# EAGLE design BatteryCombinerControlBoard (EAGLE 9.3.2)
Assembly variants: Wing, Hull

## Sheet 1 of 2
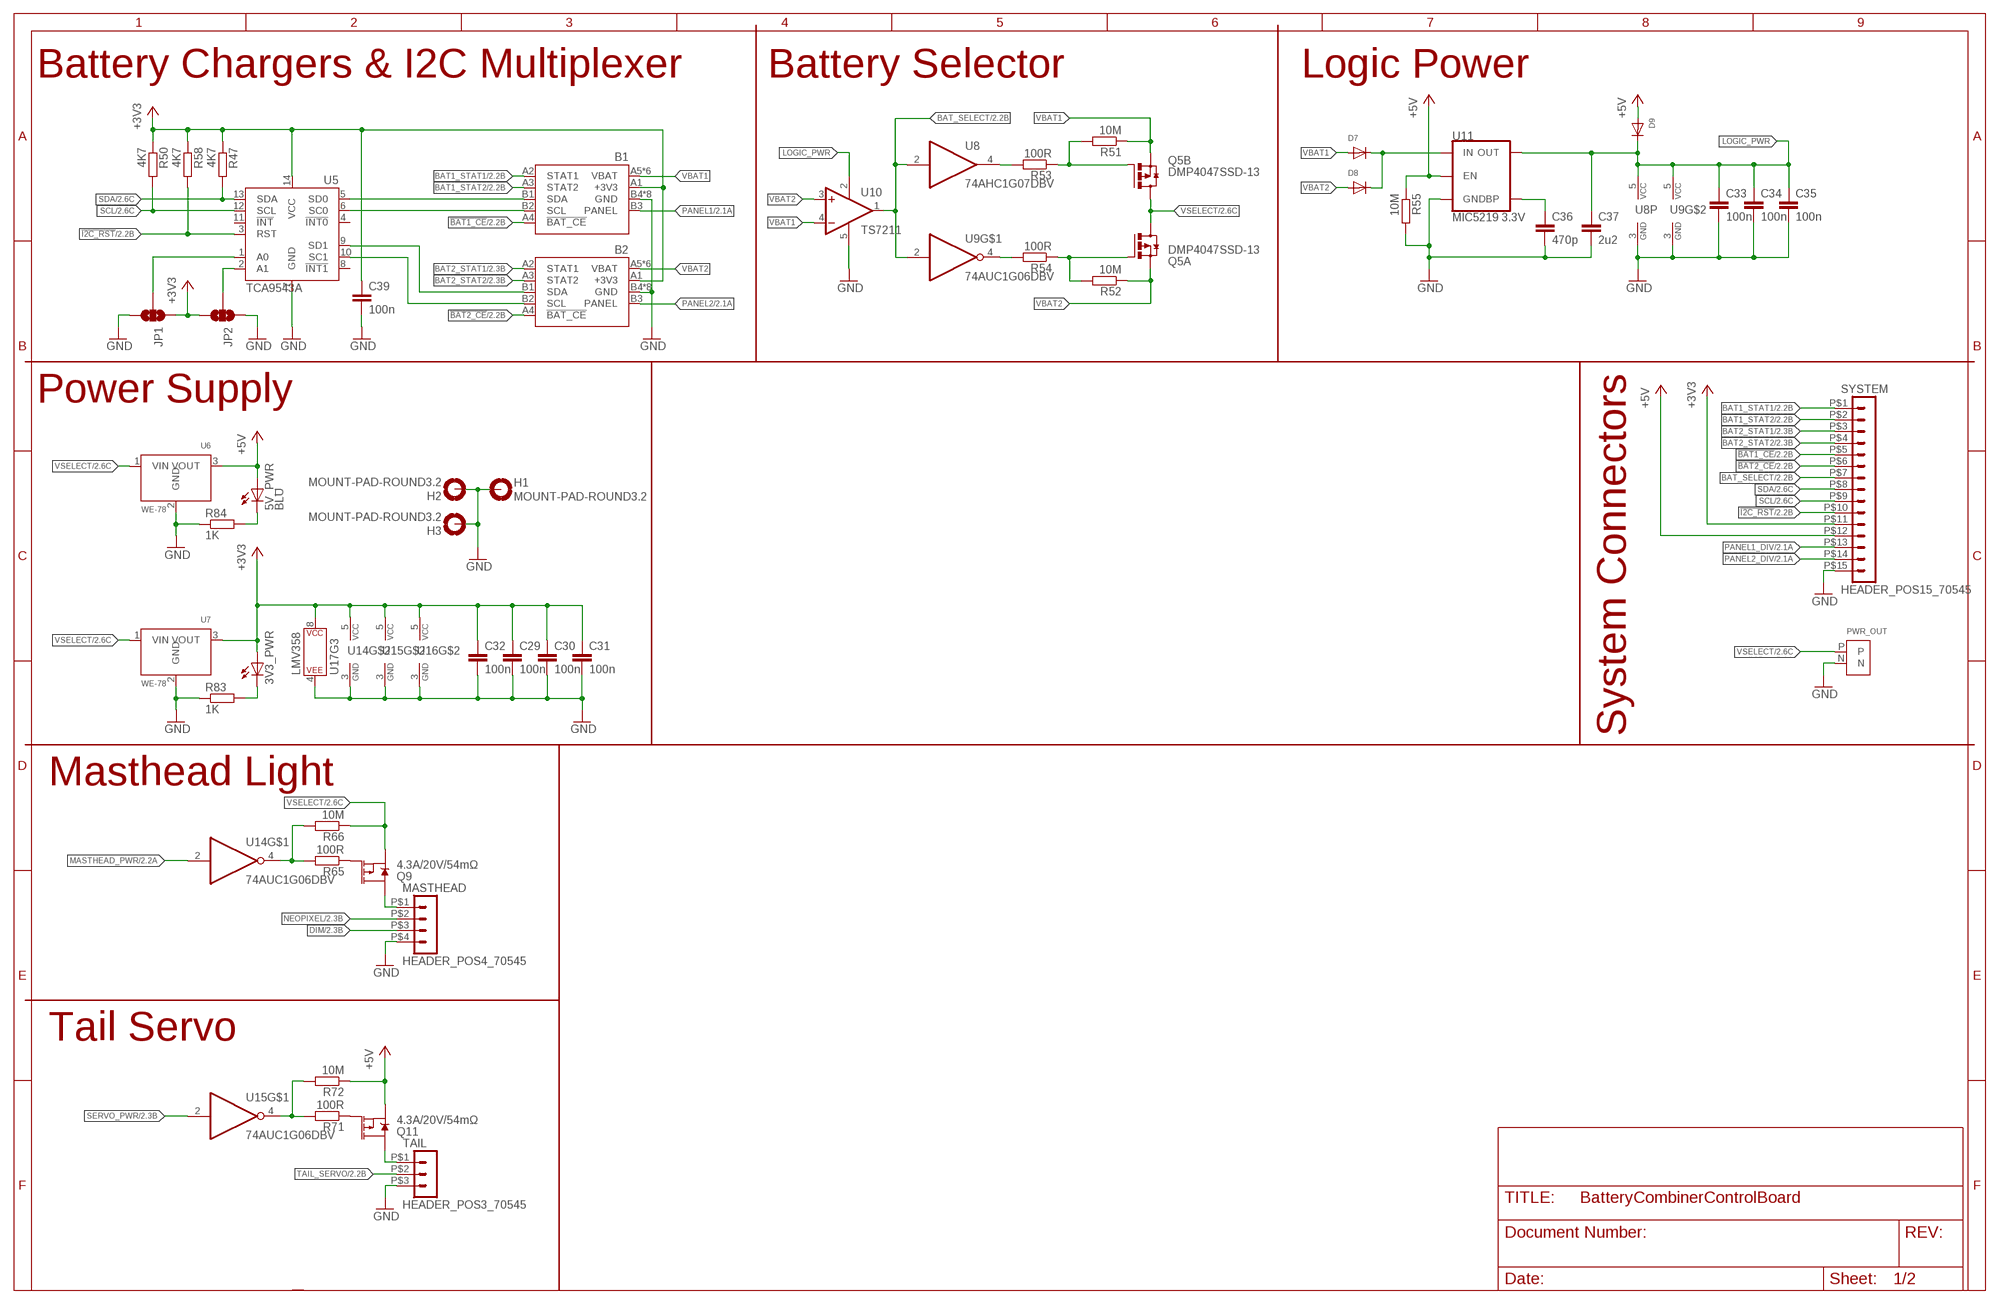
[diagram p0: schematic, sheet 1]

### Parts
3V3_PWR  GRN  LEDCHIP-LED0603  [CHIP-LED0603]
5V_PWR  BLU  LEDCHIP-LED0603  [CHIP-LED0603]
B1  MPPTCHARGER  [MPPTCHARGER]
B2  MPPTCHARGER  [MPPTCHARGER]
C29  100n  C-EUC0603  [C0603]
C30  100n  C-EUC0603  [C0603]
C31  100n  C-EUC0603  [C0603]
C32  100n  C-EUC0603  [C0603]
C33  100n  C-EUC0603  [C0603]
C34  100n  C-EUC0603  [C0603]
C35  100n  C-EUC0603  [C0603]
C36  470p  C-EUC0603  [C0603]
C37  2u2  C-EUC0603  [C0603]
C39  100n  C-EUC0603  [C0603]
D7  DIODESOD-123  [SOD-123]
D8  DIODESOD-123  [SOD-123]
D9  DIODESOD-123  [SOD-123]
H1  MOUNT-PAD-ROUND3.2  [3,2-PAD]  (not fitted in variant Wing)  (not fitted in variant Hull)
H2  MOUNT-PAD-ROUND3.2  [3,2-PAD]  (not fitted in variant Wing)  (not fitted in variant Hull)
H3  MOUNT-PAD-ROUND3.2  [3,2-PAD]  (not fitted in variant Wing)  (not fitted in variant Hull)
JP1  JUMPER-SMT_3_NO_SILK  [SMT-JUMPER_3_NO_SILK]  (not fitted in variant Wing)  (not fitted in variant Hull)
JP2  JUMPER-SMT_3_NO_SILK  [SMT-JUMPER_3_NO_SILK]  (not fitted in variant Wing)  (not fitted in variant Hull)
MASTHEAD  HEADER_POS4_70545  [70545-POS4]  (not fitted in variant Hull)
PWR_OUT  PWR  [JST-XH2-THRUHOLE]  (not fitted in variant Wing)
Q5  DMP4047SSD-13  [SO08]
Q9  4.3A/20V/54mΩ  MOSFET_PCH-IRLML2244  [SOT23-3]
Q11  4.3A/20V/54mΩ  MOSFET_PCH-IRLML2244  [SOT23-3]
R47  4K7  R-EU_R0603  [R0603]
R50  4K7  R-EU_R0603  [R0603]
R51  10M  R-EU_R0603  [R0603]
R52  10M  R-EU_R0603  [R0603]
R53  100R  R-EU_R0603  [R0603]
R54  100R  R-EU_R0603  [R0603]
R55  10M  R-EU_R0603  [R0603]
R58  4K7  R-EU_R0603  [R0603]
R65  100R  R-EU_R0603  [R0603]
R66  10M  R-EU_R0603  [R0603]
R71  100R  R-EU_R0603  [R0603]
R72  10M  R-EU_R0603  [R0603]
R83  1K  R-EU_R0603  [R0603]
R84  1K  R-EU_R0603  [R0603]
SYSTEM  HEADER_POS15_70545  [70545-POS15]  (not fitted in variant Wing)
TAIL  HEADER_POS3_70545  [70545-POS3]  (not fitted in variant Hull)
U5  TCA9543A  [SO-14]
U6  WE-78  [WE-78]
U7  WE-78  [WE-78]
U8  74AHC1G07DBV  [SOT23-5]
U9  74AUC1G06DBV  [SOT23-5]
U10  TS7211  [DBV-R-PDSO-G5]
U11  MIC5219 3.3V  V_REG_MIC52193.3V  [SOT23-5]
U14  74AUC1G06DBV  [SOT23-5]
U15  74AUC1G06DBV  [SOT23-5]
U16  74AUC1G06DBV  [SOT23-5]
U17  LMV358  LMV358SOIC  [SO08]

### Nets
!BAT1_CE!: B1.A4(!BAT_CE!) SYSTEM.P$5 ; also sheet 2
!BAT2_CE!: B2.A4(!BAT_CE!) SYSTEM.P$6 ; also sheet 2
!I2C_RST!: R58.2 SYSTEM.P$10 U5.3(RST) ; also sheet 2
+3V3: 3V3_PWR.A B1.A1(+3V3) B2.A1(+3V3) C29.1 C30.1 C31.1 C32.1 C39.1 JP1.1 JP2.3 R47.1 R50.1 R58.1 SYSTEM.P$11 U5.14(VCC) U7.3(VOUT) U14.5(VCC) U15.5(VCC) U16.5(VCC) U17.8(P$V+) ; also sheet 2
+5V: 5V_PWR.A D9.A Q11.2(S) R55.1 R72.1 SYSTEM.P$12 U6.3(VOUT) U11.3(EN) ; also sheet 2
BAT1_STAT1: B1.A2(STAT1) SYSTEM.P$1 ; also sheet 2
BAT1_STAT2: B1.A3(STAT2) SYSTEM.P$2 ; also sheet 2
BAT2_STAT1: B2.A2(STAT1) SYSTEM.P$3 ; also sheet 2
BAT2_STAT2: B2.A3(STAT2) SYSTEM.P$4 ; also sheet 2
BAT_SELECT: SYSTEM.P$7 U8.2(I) U9.2(I) U10.1(OUT) ; also sheet 2
DIM: MASTHEAD.P$3 ; also sheet 2
GND: B1.B4(GND) B1.B5(GND) B1.B6(GND) B1.B7(GND) B1.B8(GND) B1.B9(GND) B1.B10(GND) B1.H(GND) B2.B4(GND) B2.B5(GND) B2.B6(GND) B2.B7(GND) B2.B8(GND) B2.B9(GND) B2.B10(GND) B2.H(GND) C29.2 C30.2 C31.2 C32.2 C33.2 C34.2 C35.2 C36.2 C37.2 C39.2 H1.B3,2(MOUNT) H2.B3,2(MOUNT) H3.B3,2(MOUNT) JP1.3 JP2.1 MASTHEAD.P$4 PWR_OUT.N R55.2 R83.1 R84.1 SYSTEM.P$15 TAIL.P$3 U5.7(GND) U6.2(GND) U7.2(GND) U8.3(GND) U9.3(GND) U10.5(GND) U11.2(GND) U14.3(GND) U15.3(GND) U16.3(GND) U17.4(P$V-) ; also sheet 2
LOGIC_PWR: C33.1 C34.1 C35.1 C37.1 D9.C U8.5(VCC) U9.5(VCC) U10.2(V+) U11.5(OUT)
MASTHEAD_PWR: U14.2(I) ; also sheet 2
N$48: Q5.4(B:G) R51.2 R53.1
N$50: JP1.2 U5.1(A0)
N$51: JP2.2 U5.2(A1)
N$52: Q5.2(A:G) R52.2 R54.1
N$54: R54.2 U9.4(O)
N$55: R53.2 U8.4(O)
N$57: D7.C D8.C U11.1(IN)
N$58: MASTHEAD.P$1 Q9.3(D)
N$59: C36.1 U11.4(BP)
N$63: Q9.1(G) R65.1
N$64: R65.2 R66.2 U14.4(O)
N$70: Q11.3(D) TAIL.P$1
N$71: Q11.1(G) R71.1
N$72: R71.2 R72.2 U15.4(O)
N$74: 3V3_PWR.C R83.2
N$77: 5V_PWR.C R84.2
NEOPIXEL: MASTHEAD.P$2 ; also sheet 2
PANEL1: B1.B3(PANEL) ; also sheet 2
PANEL1_DIV: SYSTEM.P$13 ; also sheet 2
PANEL2: B2.B3(PANEL) ; also sheet 2
PANEL2_DIV: SYSTEM.P$14 ; also sheet 2
SCL: R50.2 SYSTEM.P$9 U5.12(SCL) ; also sheet 2
SCL1: B1.B2(SCL) U5.6(SC0)
SCL2: B2.B2(SCL) U5.10(SC1)
SDA: R47.2 SYSTEM.P$8 U5.13(SDA) ; also sheet 2
SDA1: B1.B1(SDA) U5.5(SD0)
SDA2: B2.B1(SDA) U5.9(SD1)
SERVO_PWR: U15.2(I) ; also sheet 2
TAIL_SERVO: TAIL.P$2 ; also sheet 2
VBAT1: B1.A5(VBAT) B1.A6(VBAT) B1.A7(VBAT) B1.A8(VBAT) B1.A9(VBAT) B1.A10(VBAT) D7.A Q5.3(B:S) R51.1 U10.4(-IN)
VBAT2: B2.A5(VBAT) B2.A6(VBAT) B2.A7(VBAT) B2.A8(VBAT) B2.A9(VBAT) B2.A10(VBAT) D8.A Q5.1(A:S) R52.1 U10.3(+IN)
VSELECT: PWR_OUT.P Q5.5(B:D) Q5.6(B:D) Q5.7(A:D) Q5.8(A:D) Q9.2(S) R66.1 U6.1(VIN) U7.1(VIN) ; also sheet 2
Unconnected: U5.4(!INT0!) U5.8(!INT1!) U5.11(!INT!)

### Notes on the sheet
- Battery Chargers & I2C Multiplexer | Battery Selector | Logic Power
- Power Supply | System Connectors
- Masthead Light
- Tail Servo

## Sheet 2 of 2
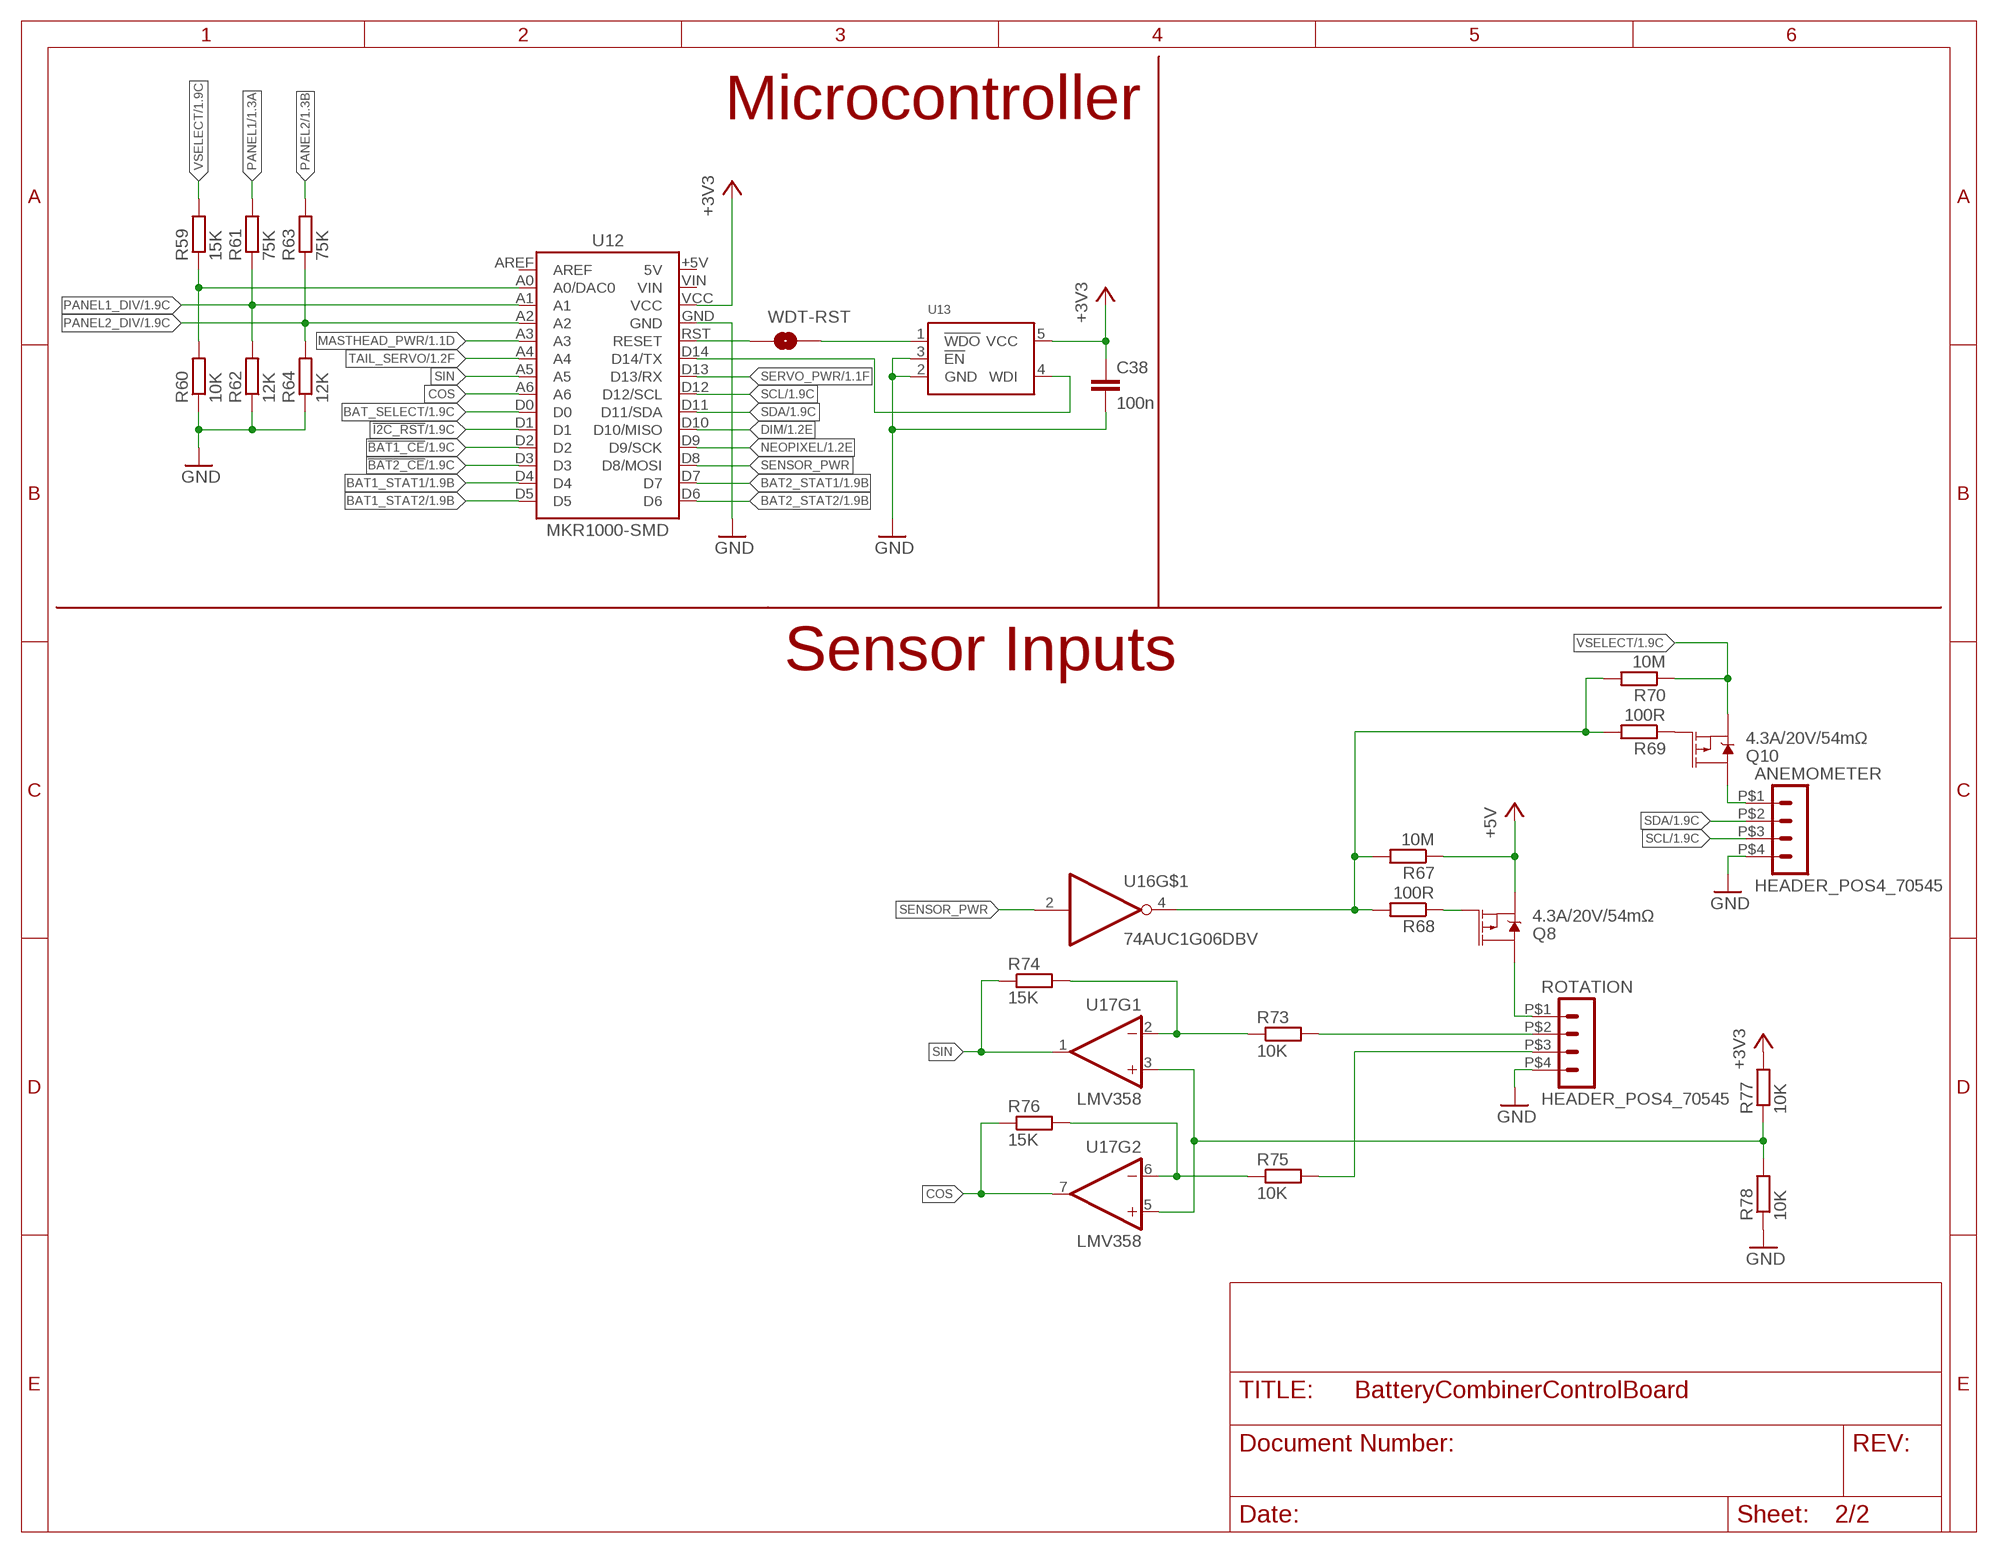
[diagram p1: schematic, sheet 2]

### Parts
ANEMOMETER  HEADER_POS4_70545  [70545-POS4]  (not fitted in variant Hull)
C38  100n  C-EUC0603  [C0603]
Q8  4.3A/20V/54mΩ  MOSFET_PCH-IRLML2244  [SOT23-3]
Q10  4.3A/20V/54mΩ  MOSFET_PCH-IRLML2244  [SOT23-3]
R59  15K  R-EU_R0603  [R0603]
R60  10K  R-EU_R0603  [R0603]
R61  75K  R-EU_R0603  [R0603]
R62  12K  R-EU_R0603  [R0603]
R63  75K  R-EU_R0603  [R0603]
R64  12K  R-EU_R0603  [R0603]
R67  10M  R-EU_R0603  [R0603]
R68  100R  R-EU_R0603  [R0603]
R69  100R  R-EU_R0603  [R0603]
R70  10M  R-EU_R0603  [R0603]
R73  10K  R-EU_R0603  [R0603]
R74  15K  R-EU_R0603  [R0603]
R75  10K  R-EU_R0603  [R0603]
R76  15K  R-EU_R0603  [R0603]
R77  10K  R-EU_R0603  [R0603]
R78  10K  R-EU_R0603  [R0603]
ROTATION  HEADER_POS4_70545  [70545-POS4]  (not fitted in variant Hull)
U12  MKR1000-SMD  [MKR1000-SMD]  (not fitted in variant Hull)
U13  STWD100  [DBV-R-PDSO-G5]  (not fitted in variant Hull)
WDT-RST  JUMPER-SMT_2_NO_SILK  [SMT-JUMPER_2_NO_SILK]  (not fitted in variant Wing)  (not fitted in variant Hull)

### Nets
!BAT1_CE!: U12.D2 ; also sheet 1
!BAT2_CE!: U12.D3 ; also sheet 1
!I2C_RST!: U12.D1 ; also sheet 1
+3V3: C38.1 R77.2 U12.VCC U13.5(VCC) ; also sheet 1
+5V: Q8.2(S) R67.1 ; also sheet 1
BAT1_STAT1: U12.D4 ; also sheet 1
BAT1_STAT2: U12.D5 ; also sheet 1
BAT2_STAT1: U12.D7 ; also sheet 1
BAT2_STAT2: U12.D6 ; also sheet 1
BAT_SELECT: U12.D0 ; also sheet 1
COS: R76.1 U12.A6 U17.7(OUT)
COS_IN: R75.2 ROTATION.P$3
DIM: U12.D10(D10/MISO) ; also sheet 1
GND: ANEMOMETER.P$4 C38.2 R60.1 R62.1 R64.1 R78.1 ROTATION.P$4 U12.GND U13.2(GND) U13.3(!EN!) ; also sheet 1
MASTHEAD_PWR: U12.A3 ; also sheet 1
N$2: Q8.3(D) ROTATION.P$1
N$53: Q8.1(G) R68.1
N$60: R59.1 R60.2 U12.A0(A0/DAC0)
N$61: U12.RST(RESET) WDT-RST.1
N$62: R73.1 R74.2 U17.2(-IN)
N$65: U13.1(!WDO!) WDT-RST.2
N$66: ANEMOMETER.P$1 Q10.3(D)
N$67: Q10.1(G) R69.1
N$68: U12.D14(D14/TX) U13.4(WDI)
N$69: R67.2 R68.2 R69.2 R70.2 U16.4(O)
N$73: R75.1 R76.2 U17.6(-IN)
N$78: R77.1 R78.2 U17.3(+IN) U17.5(+IN)
NEOPIXEL: U12.D9(D9/SCK) ; also sheet 1
PANEL1: R61.2 ; also sheet 1
PANEL1_DIV: R61.1 R62.2 U12.A1 ; also sheet 1
PANEL2: R63.2 ; also sheet 1
PANEL2_DIV: R63.1 R64.2 U12.A2 ; also sheet 1
SCL: ANEMOMETER.P$3 U12.D12(D12/SCL) ; also sheet 1
SDA: ANEMOMETER.P$2 U12.D11(D11/SDA) ; also sheet 1
SENSOR_PWR: U12.D8(D8/MOSI) U16.2(I)
SERVO_PWR: U12.D13(D13/RX) ; also sheet 1
SIN: R74.1 U12.A5 U17.1(OUT)
SIN_IN: R73.2 ROTATION.P$2
TAIL_SERVO: U12.A4 ; also sheet 1
VSELECT: Q10.2(S) R59.2 R70.1 ; also sheet 1
Unconnected: U12.+5V(5V) U12.AREF U12.VIN

### Notes on the sheet
- Microcontroller
- Sensor Inputs

## Library data of the parts
3V3_PWR 5V_PWR = adafruit:LED: LED OSRAM: - CHIPLED LG R971, LG N971, LY N971, LG Q971, LY Q971, LO R971, LY R971 LH N974, LH R974 LS Q976, LO Q976, LY Q976 LO Q996 - Hyper CHIPLED LW Q18S LB Q993, LB Q99A, LB R99A - SideLED LS A670, LO A670, LY A670, LG A670, LP A670 LB A673, LV A673, LT A673, LW A673 LH A674 LY A675 LS A676, LA A676, LO A676, LY A676, LW A676 LS A679, LY A679, LG A679 - Hyper Micro SIDELED® LS Y876, LA Y876, LO Y876, LY Y876 LT Y87S - SmartLED LW L88C, LW L88S LB L89C, LB L89S, LG L890 LS L89K, LO L89K, LY L89K LS L896, LA L896, LO L896, LY L896 - TOPLED LS T670, LO T670, LY T670, LG T670, LP T670 LSG T670, LSP T670, LSY T670, LOP T670, LYG T670 LG T671, LOG T671, LSG T671 LB T673, LV T673, LT T673, LW T673 LH T674 LS T676, LA T676, LO T676, LY T676, LB T676, LH T676, LSB T676, LW T676 LB T67C, LV T67C, LT T67C, LS T67K, LO T67K, LY T67K, LW E67C LS E67B, LA E67B, LO E67B, LY E67B, LB E67C, LV E67C, LT E67C LW T67C LS T679, LY T679, LG T679 LS T770, LO T770, LY T770, LG T770, LP T770 LB T773, LV T773, LT T773, LW T773 LH T774 LS E675, LA E675, LY E675, LS T675 LS T776, LA T776, LO T776, LY T776, LB T776 LHGB T686 LT T68C, LB T68C - Hyper Mini TOPLED® LB M676 - Mini TOPLED Santana® LG M470 LS M47K, LO M47K, LY M47K Source: http://www.osram.convergy.de/
ANEMOMETER MASTHEAD ROTATION = con-molex-c-grid-sl:HEADER_POS4_?: Molex -C-Grid® / SL Series connector Wire-to-Board 2.54 mm (0.100") pitch header, 4 positions.
B1 B2 = CombinerBoardFootprint:MPPTCHARGER
C29-C39 = resistor:C-EU: CAPACITOR, European symbol
D7-D9 = adafruit:DIODE: Diode SMADIODE - SMA Surface Mount Package 20V 1A Schottky Diode Digikey: 641-1014-6-ND DO-1N4148 - Through Hole Small Current Diode SOD-123 20V 1 A (.5mV Vf) Schottky Diode - Digikey: MBRX120TPMSCT-ND SOD-323 10V 570mA (.38mV Vf, 3ns) Schottky Diode - Digikey: ZLLS410CT-ND SOD-523 30V 30mA Schottky Diode (RB751S-40TE61) - Digikey: RB751S-40TE61CT-ND SOT23-R/W - SOT23 Package (R = Solder Paste/Reflow Ovens, W = Hand-Soldering) BAT54Film 40V 300mA - Digikey: 497-7162-1-ND
H1-H3 = holes:MOUNT-PAD-ROUND: MOUNTING PAD, round
JP1 JP2 = SparkFun-Jumpers:JUMPER-SMT_3_NO: Normally open jumper This jumper has three pads in close proximity to each other. Apply solder to close the connection(s).
PWR_OUT = PowerComponents:PWR
Q5 = PowerComponents:DMP4047SSD-13: Dual P MOSFET
Q8-Q11 = SparkFun-DiscreteSemi:MOSFET_PCH: P-channel MOSFETs Voltage controlled devices that allow control of high current outputs. SparkFun Products: SparkFun ESP32 Thing <https://www.sparkfun.com/products/13907> SparkFun ESP8266 Thing <https://www.sparkfun.com/products/13231>; PROD_ID: TRANS-11153
R47 R50-R55 R58-R78 R83 R84 = resistor:R-EU_: RESISTOR, European symbol
SYSTEM = con-molex-c-grid-sl:HEADER_POS15_?: Molex -C-Grid® / SL Series connector Wire-to-Board 2.54 mm (0.100") pitch header, 15 positions.
TAIL = con-molex-c-grid-sl:HEADER_POS3_?: Molex -C-Grid® / SL Series connector Wire-to-Board 2.54 mm (0.100") pitch header, 3 positions.
U5 = PowerComponents:TCA9543A: 2 port I2C mux
U6 U7 = PowerComponents:WE-78
U8 = 74xx-little-us:74*1G07: Single Buffer/Driver With Open-Drain Output
U9 U14-U16 = 74xx-little-us:74*1G06: Single Inverter Buffer/Driver With Open-Drain Output
U10 = PowerComponents:TS7211: Single rail to rail differential comparator. Source: datasheet <http://www.st.com/content/ccc/resource/technical/document/datasheet/3e/f6/43/6f/0f/1f/48/68/CD00003022.pdf/files/CD00003022.pdf/jcr:content/translations/en.CD00003022.pdf>
U11 = SparkFun-IC-Power:V_REG_MIC5219: V_REG MIC5219 Standard 3.3V and 5V 500mA LDO voltage regulator in SOT-23 layout. Micrel part MIC5219. BP (by-pass) pin is used to lower output noise with 470pF cap, may be left open.; PROD_ID: VREG-09872
U12 = arduino-shields:MKR: Through hole version can use any 0.1" headers. SMD version uses Mill-Max p/n 310-43-114-41-105000. This requires a machined-pin header such as the Mill-Max p/n 350-10-114-00-006000.
U13 = PowerComponents:STWD100
U17 = SparkFun-IC-Amplifiers:LMV358: IC LMV358 DUAL OP AMP Jellybean rail-to-rail output op-amp SparkFun Products SparkFun PicoBoard <https://www.sparkfun.com/products/11888> (WIG-11888) SparkFun Vernier Interface Shield <https://www.sparkfun.com/products/12858> (DEV-12858) SparkFun Blynk Board - ESP8266 <https://www.sparkfun.com/products/13794> (WRL-13794) SparkFun Digital Sandbox <https://www.sparkfun.com/products/12651> (DEV-12651 RoHS); PROD_ID: IC-09657
WDT-RST = SparkFun-Jumpers:JUMPER-SMT_2_NO: Normally open jumper This jumper has two pads in close proximity to each other. Apply solder to close the connection. Round pads are easier to solder for beginners, but are a lot larger. SparkFun Product that uses the round pads: SparkFun EL Sequencer <https://www.sparkfun.com/products/12781>

## Board
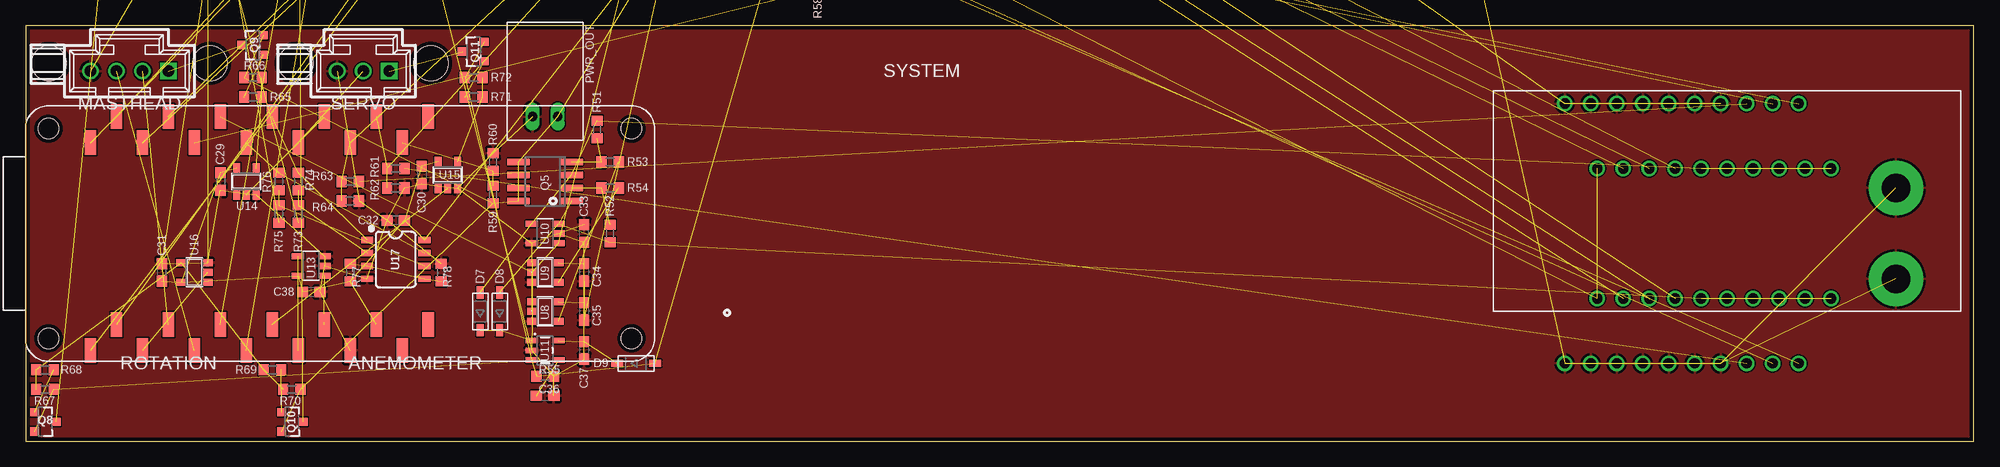
[diagram p2: board, top side]
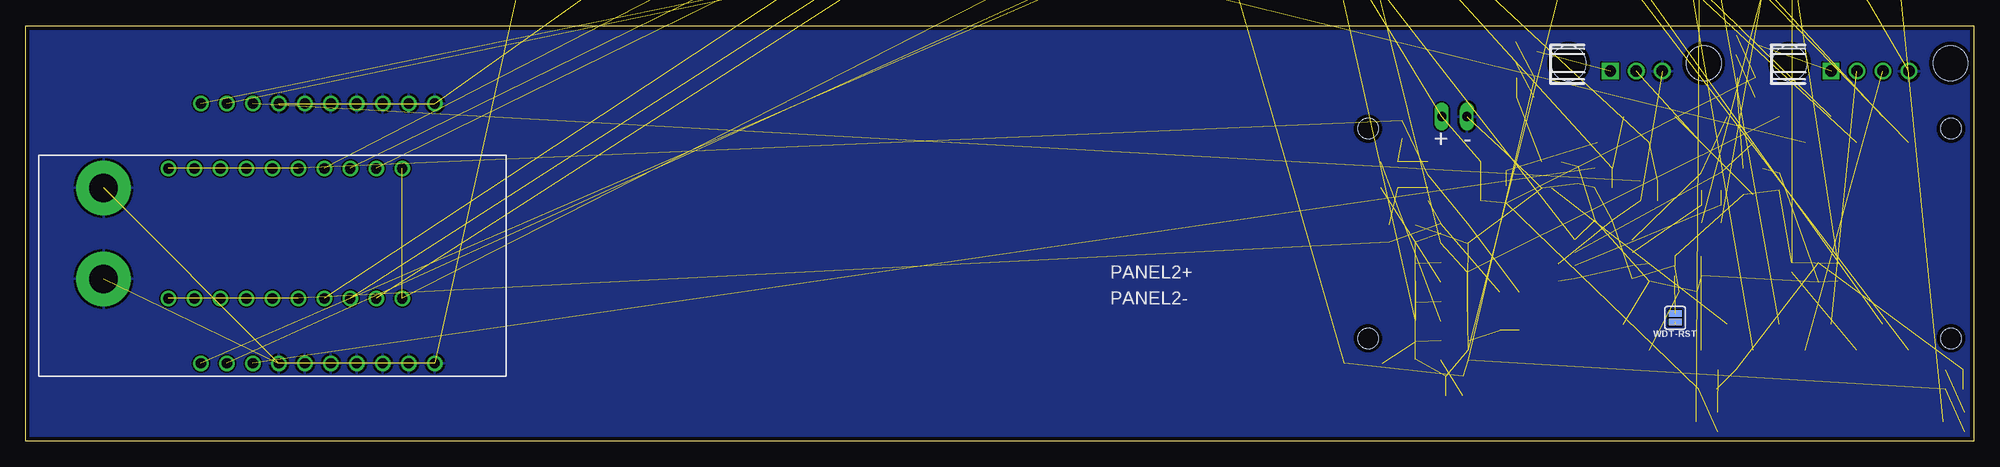
[diagram p3: board, bottom side, seen from below]

Size 190.5 x 40.64 mm. Coordinates in mm from the lower left corner, seen from the top.
Outline: 0,0 190.5,0 190.5,40.64 0,40.64 0,0
Copper layers (1*16): Top 0.0356mm / dielectric 1.5011mm / Bottom 0.0356mm
Design rules "LaenPCBOrder *": minimum track width 6mil, minimum drill 13mil, track to track 6mil, track to pad 6mil, pad to pad 6mil, via to via 6mil, smd to smd 6mil, copper to edge 15mil, drill to drill 6mil, minimum pad ring 7mil, minimum via ring 7mil, stop-mask expansion 4mil, vias tented up to drill 30mil, thermal gap 10mil

### Footprints (pad centres in the part's own frame; a part is rotated, then mirrored left to right if it is on the bottom)
CHIP-LED0603 = smd 0.8 x 0.8: A 0,-0.75; C 0,0.75
70545-POS4 = drill 1.1 square: P$1 3.81,0 | drill 1.1: P$2 1.27,0; P$3 -1.27,0; P$4 -3.81,0 | hole 3.404: -7.874,0.762; 7.874,0.762
MPPTCHARGER = drill 1: A1 10.16,1.27; A2 12.7,1.27; A3 15.24,1.27; A4 17.78,1.27; A5 20.32,1.27; A6 22.86,1.27; A7 25.4,1.27; A8 27.94,1.27; A9 30.48,1.27; A10 33.02,1.27; B1 29.845,20.32; B2 27.305,20.32; B3 24.765,20.32; B4 22.225,20.32; B5 19.685,20.32; B6 17.145,20.32; B7 14.605,20.32; B8 12.065,20.32; B9 9.525,20.32; B10 6.985,20.32 | drill 2.8 pad 5.334: H 39.37,3.175
C0603 = smd 1.1 x 1: 1 -0.85,0; 2 0.85,0
SOD-123 = smd 1.2 x 0.7: A 1.85,0; C -1.85,0
3,2-PAD = drill 3.2 pad 5.842: B3,2 0,0
SMT-JUMPER_3_NO_SILK = smd 0.635 x 1.27: 1 -0.813,0; 2 0,0; 3 0.813,0
JST-XH2-THRUHOLE = drill 0.9 long: N -1.23,0; P 1.23,0
SO08 = smd 0.6 x 2.2: 1 -1.905,-2.6; 2 -0.635,-2.6; 3 0.635,-2.6; 4 1.905,-2.6; 5 1.905,2.6; 6 0.635,2.6; 7 -0.635,2.6; 8 -1.905,2.6
SOT23-3 = smd 0.8 x 0.9: 1 -0.95,-1; 2 0.95,-1; 3 0,1.1
R0603 = smd 1 x 1.1: 1 -0.85,0; 2 0.85,0
70545-POS15 = drill 1.1 square: P$1 17.78,0 | drill 1.1: P$2 15.24,0; P$3 12.7,0; P$4 10.16,0; P$5 7.62,0; P$6 5.08,0; P$7 2.54,0; P$8 0,0; P$9 -2.54,0; P$10 -5.08,0; P$11 -7.62,0; P$12 -10.16,0; P$13 -12.7,0; P$14 -15.24,0; P$15 -17.78,0 | hole 3.404: -21.844,0.762; 21.844,0.762
70545-POS3 = drill 1.1 square: P$1 2.54,0 | drill 1.1: P$2 0,0; P$3 -2.54,0 | hole 3.404: -6.604,0.762; 6.604,0.762
SO-14 = smd 0.6 x 2.2: 1 -3.81,-2.6; 2 -2.54,-2.6; 3 -1.27,-2.6; 4 0,-2.6; 5 1.27,-2.6; 6 2.54,-2.6; 7 3.81,-2.6; 8 3.81,2.6; 9 2.54,2.6; 10 1.27,2.6; 11 0,2.6; 12 -1.27,2.6; 13 -2.54,2.6; 14 -3.81,2.6
WE-78 = drill 0.9 long: 1 -2.54,0; 2 0,0; 3 2.54,0
SOT23-5 = smd 0.69 x 0.99: 1 -0.95,-1.29; 2 0,-1.29; 3 0.95,-1.29; 4 0.95,1.3; 5 -0.95,1.3
DBV-R-PDSO-G5 = smd 0.6 x 1.2: 1 -0.95,-1.306; 2 0,-1.306; 3 0.95,-1.306; 4 0.95,1.306; 5 -0.95,1.306
SOT23-5' = smd 0.55 x 1.2: 1 -0.95,-1.3; 2 0,-1.3; 3 0.95,-1.3; 4 0.95,1.3; 5 -0.95,1.3
MKR1000-SMD = smd 1.143 x 2.413: +5V 39.37,-8.89; A0 36.83,8.89; A1 34.29,11.43; A2 31.75,8.89; A3 29.21,11.43; A4 26.67,8.89; A5 24.13,11.43; A6 21.59,8.89; AREF 39.37,11.43; D0 19.05,11.43; D1 16.51,8.89; D2 13.97,11.43; D3 11.43,8.89; D4 8.89,11.43; D5 6.35,8.89; D6 6.35,-11.43; D7 8.89,-8.89; D8 11.43,-11.43; D9 13.97,-8.89; D10 16.51,-11.43; D11 19.05,-8.89; D12 21.59,-11.43; D13 24.13,-8.89; D14 26.67,-11.43; GND 31.75,-11.43; RST 29.21,-8.89; VCC 34.29,-8.89; VIN 36.83,-11.43 | hole 2: 2.25,10.25; 2.25,-10.25; 59.25,-10.25; 59.25,10.25
SO08' = smd 0.6 x 1.2: 1 -1.905,-2.8; 2 -0.635,-2.8; 3 0.635,-2.8; 4 1.905,-2.8; 5 1.905,2.8; 6 0.635,2.8; 7 -0.635,2.8; 8 -1.905,2.8
SMT-JUMPER_2_NO_SILK = smd 0.635 x 1.27: 1 -0.406,0; 2 0.406,0

### Placement (x,y rotation side)
3V3_PWR  77.47,64.77 180 top  (outside the outline)
5V_PWR  80.64,73.03 180 top  (outside the outline)
ANEMOMETER  30.48,68.58 180 top  (outside the outline)
B1  143.51,27.94 180 bottom
B2  143.51,12.7 0 top
C29  19.05,25.4 270 top
C30  38.73,26.04 270 top
C31  13.34,16.51 90 top
C32  36.2,21.59 180 top
C33  54.61,20.32 90 top
C34  54.61,16.51 270 top
C35  54.61,12.7 270 top
C36  50.8,4.45 0 top
C37  54.61,8.89 270 top
C38  27.94,14.61 0 top
C39  62.87,49.53 270 top  (outside the outline)
D7  44.45,12.7 90 top
D8  46.35,12.7 90 top
D9  59.69,7.62 0 top
H1  140.34,53.34 0 top  (outside the outline)
H2  175.9,53.34 0 top  (outside the outline)
H3  19.68,59.05 0 top  (outside the outline)
JP1  53.34,50.16 180 top  (outside the outline)
JP2  57.15,45.72 180 top  (outside the outline)
MASTHEAD  10.16,36.2 0 top
PWR_OUT  50.8,31.75 0 top
Q5  50.8,25.4 90 top
Q8  1.91,1.91 270 top
Q9  22.23,38.73 90 top
Q10  26.04,1.91 270 top
Q11  43.81,38.1 90 top
R47  66.67,47.62 270 top  (outside the outline)
R50  73.03,49.53 270 top  (outside the outline)
R51  55.88,30.48 270 top
R52  57.15,20.32 90 top
R53  57.15,27.3 0 top
R54  57.15,24.77 0 top
R55  50.8,6.35 0 top
R58  77.47,45.09 90 top  (outside the outline)
R59  45.72,24.13 270 top
R60  45.72,27.3 270 top
R61  36.2,26.67 0 top
R62  36.2,24.77 180 top
R63  31.75,25.4 0 top
R64  31.75,23.5 180 top
R65  22.23,33.66 0 top
R66  22.23,35.56 0 top
R67  1.91,5.08 180 top
R68  1.91,6.99 180 top
R69  24.13,6.99 180 top
R70  26.04,5.08 180 top
R71  43.81,33.66 0 top
R72  43.81,35.56 0 top
R73  26.67,22.23 270 top
R74  26.67,25.4 270 top
R75  24.77,22.23 270 top
R76  24.77,25.4 270 top
R77  31.75,16.51 270 top
R78  40.64,16.51 270 top
R83  83.82,58.42 90 top  (outside the outline)
R84  90.17,56.52 90 top  (outside the outline)
ROTATION  13.97,74.3 180 top  (outside the outline)
SYSTEM  69.22,78.11 180 top  (outside the outline)
TAIL  33.02,36.2 0 top
U5  84.45,48.26 0 top  (outside the outline)
U6  48.26,57.78 0 top  (outside the outline)
U7  69.22,55.88 0 top  (outside the outline)
U8  50.8,12.7 270 top
U9  50.8,16.51 270 top
U10  50.8,20.32 90 top
U11  MIC5219 3.3V  [SOT23-5']  50.8,8.89 270 top
U12  0,20.32 0 top
U13  27.94,17.14 90 top
U14  21.59,25.4 0 top
U15  41.27,26.04 0 top
U16  16.51,16.51 90 top
U17  LMV358  [SO08']  36.2,17.78 270 top
WDT-RST  29.21,12.06 90 bottom

### Tracks (layer width: path | path; a pad name or v marks a point on that pad's centre or on a via)
!BAT1_CE!  (2 unrouted)
!BAT2_CE!  (2 unrouted)
!I2C_RST!  (3 unrouted)
+3V3  (23 unrouted)
+5V  (9 unrouted)
BAT1_STAT1  (2 unrouted)
BAT1_STAT2  (2 unrouted)
BAT2_STAT1  (2 unrouted)
BAT2_STAT2  (2 unrouted)
BAT_SELECT  (4 unrouted)
COS  (2 unrouted)
COS_IN  (1 unrouted)
DIM  (1 unrouted)
GND  (58 unrouted)
  pour Top: 0,0 191.13,0 191.13,41.91 0,41.91
  pour Bottom: 0,0 0,42.55 191.13,42.55 191.13,0
LOGIC_PWR  (8 unrouted)
MASTHEAD_PWR  (1 unrouted)
N$2  (1 unrouted)
N$48  (2 unrouted)
N$50  (1 unrouted)
N$51  (1 unrouted)
N$52  (2 unrouted)
N$53  (1 unrouted)
N$54  (1 unrouted)
N$55  (1 unrouted)
N$57  (2 unrouted)
N$58  (1 unrouted)
N$59  (1 unrouted)
N$60  (2 unrouted)
N$61  (1 unrouted)
N$62  (2 unrouted)
N$63  (1 unrouted)
N$64  (2 unrouted)
N$65  (1 unrouted)
N$66  (1 unrouted)
N$67  (1 unrouted)
N$68  (1 unrouted)
N$69  (4 unrouted)
N$70  (1 unrouted)
N$71  (1 unrouted)
N$72  (2 unrouted)
N$73  (2 unrouted)
N$74  (1 unrouted)
N$77  (1 unrouted)
N$78  (3 unrouted)
NEOPIXEL  (1 unrouted)
PANEL1  (1 unrouted)
PANEL1_DIV  (3 unrouted)
PANEL2  (1 unrouted)
PANEL2_DIV  (3 unrouted)
SCL  (4 unrouted)
SCL1  (1 unrouted)
SCL2  (1 unrouted)
SDA  (4 unrouted)
SDA1  (1 unrouted)
SDA2  (1 unrouted)
SENSOR_PWR  (1 unrouted)
SERVO_PWR  (1 unrouted)
SIN  (2 unrouted)
SIN_IN  (1 unrouted)
TAIL_SERVO  (1 unrouted)
VBAT1  (9 unrouted)
VBAT2  (9 unrouted)
VSELECT  (11 unrouted)

### Text on the board
tPlace: SYSTEM | MASTHEAD | SERVO | ROTATION | ANEMOMETER
bPlace: PANEL1+ | PANEL1- | - | + | PANEL2+ | PANEL2-